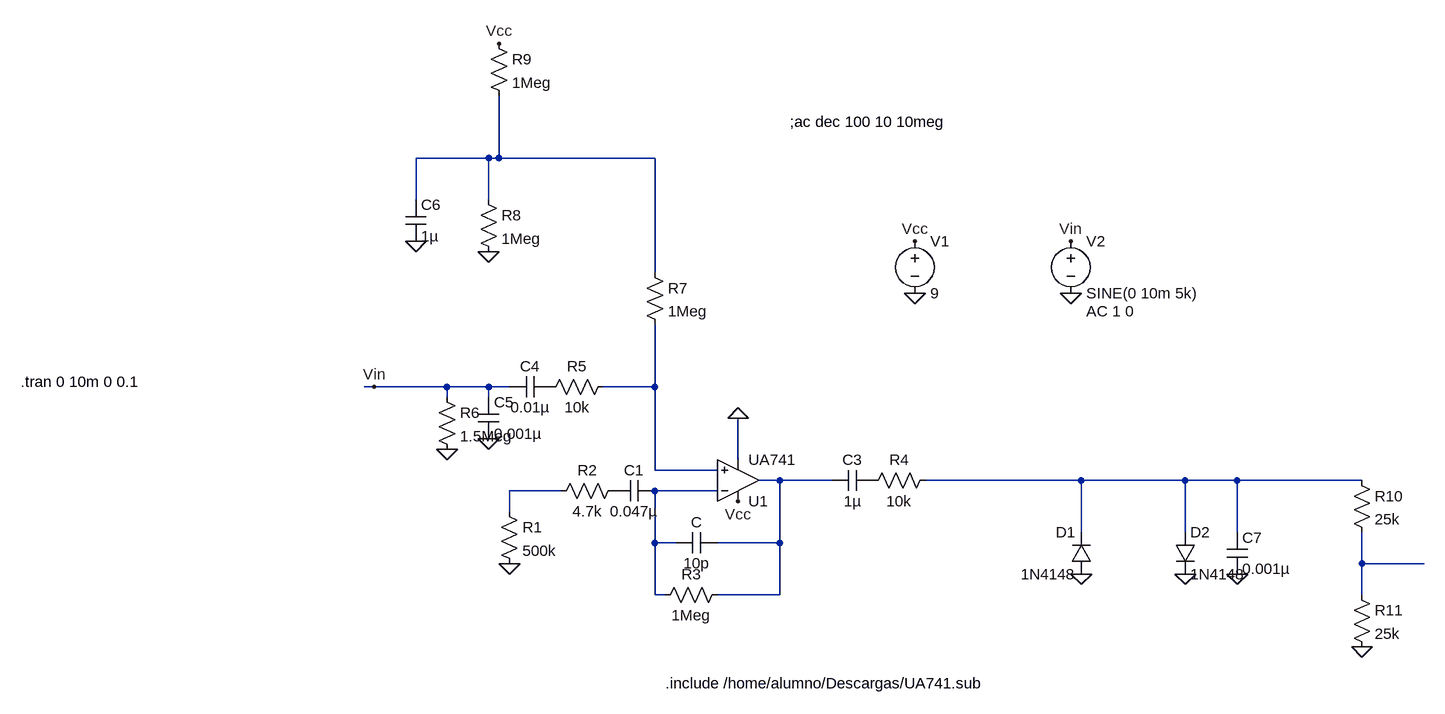
[diagram p0: schematic circuito_rta_frecuencia.asc]
circuito_rta_frecuencia.asc, the LTspice schematic file:
Version 4
SHEET 1 1428 936
WIRE -16 112 -128 112
WIRE 0 112 0 16
WIRE 0 112 -16 112
WIRE 240 112 0 112
WIRE -128 176 -128 112
WIRE -16 176 -16 112
WIRE 240 288 240 112
WIRE -192 464 -208 464
WIRE -80 464 -192 464
WIRE -16 464 -80 464
WIRE 16 464 -16 464
WIRE 240 464 240 368
WIRE 240 464 160 464
WIRE -80 480 -80 464
WIRE -16 480 -16 464
WIRE 368 576 368 512
WIRE 240 592 240 464
WIRE 336 592 240 592
WIRE 432 608 400 608
WIRE 512 608 432 608
WIRE 896 608 656 608
WIRE 1056 608 896 608
WIRE 1136 608 1056 608
WIRE 1328 608 1136 608
WIRE 96 624 16 624
WIRE 336 624 240 624
WIRE 16 656 16 624
WIRE 896 688 896 608
WIRE 1056 688 1056 608
WIRE 1136 688 1136 608
WIRE 240 704 240 624
WIRE 272 704 240 704
WIRE 432 704 432 608
WIRE 432 704 336 704
WIRE 1328 736 1328 688
WIRE 1424 736 1328 736
WIRE 240 784 240 704
WIRE 256 784 240 784
WIRE 432 784 432 704
WIRE 432 784 336 784
WIRE 1328 784 1328 736
FLAG 16 736 0
FLAG 368 512 0
FLAG -80 560 0
FLAG -16 544 0
FLAG -128 240 0
FLAG -16 256 0
FLAG 896 752 0
FLAG 1056 752 0
FLAG 1136 752 0
FLAG 1328 864 0
FLAG 640 240 Vcc
FLAG 0 -64 Vcc
FLAG 880 240 Vin
FLAG -192 464 Vin
FLAG 640 320 0
FLAG 880 320 0
FLAG 368 640 Vcc
SYMBOL res 0 640 R0
SYMATTR InstName R1
SYMATTR Value 500k
SYMBOL res 192 608 R90
WINDOW 0 0 56 VBottom 2
WINDOW 3 32 56 VTop 2
SYMATTR InstName R2
SYMATTR Value 4.7k
SYMBOL cap 240 608 R90
WINDOW 0 0 32 VBottom 2
WINDOW 3 32 32 VTop 2
SYMATTR InstName C1
SYMATTR Value 0.047µ
SYMBOL cap 336 688 R90
WINDOW 0 0 32 VBottom 2
WINDOW 3 32 32 VTop 2
SYMATTR InstName C
SYMATTR Value 10p
SYMBOL res 352 768 R90
WINDOW 0 0 56 VBottom 2
WINDOW 3 32 56 VTop 2
SYMATTR InstName R3
SYMATTR Value 1Meg
SYMBOL Opamps\\opamp2 368 672 M180
SYMATTR InstName U1
SYMATTR Value UA741
SYMBOL cap 576 592 R90
WINDOW 0 0 32 VBottom 2
WINDOW 3 32 32 VTop 2
SYMATTR InstName C3
SYMATTR Value 1µ
SYMBOL res 672 592 R90
WINDOW 0 0 56 VBottom 2
WINDOW 3 32 56 VTop 2
SYMATTR InstName R4
SYMATTR Value 10k
SYMBOL res 176 448 R90
WINDOW 0 0 56 VBottom 2
WINDOW 3 32 56 VTop 2
SYMATTR InstName R5
SYMATTR Value 10k
SYMBOL cap 80 448 R90
WINDOW 0 0 32 VBottom 2
WINDOW 3 32 32 VTop 2
SYMATTR InstName C4
SYMATTR Value 0.01µ
SYMBOL cap -32 480 R0
SYMATTR InstName C5
SYMATTR Value 0.001µ
SYMBOL res -96 464 R0
SYMATTR InstName R6
SYMATTR Value 1.5Meg
SYMBOL res 224 272 R0
SYMATTR InstName R7
SYMATTR Value 1Meg
SYMBOL cap -144 176 R0
SYMATTR InstName C6
SYMATTR Value 1µ
SYMBOL res -32 160 R0
SYMATTR InstName R8
SYMATTR Value 1Meg
SYMBOL res -16 -80 R0
SYMATTR InstName R9
SYMATTR Value 1Meg
SYMBOL res 1312 592 R0
SYMATTR InstName R10
SYMATTR Value 25k
SYMBOL res 1312 768 R0
SYMATTR InstName R11
SYMATTR Value 25k
SYMBOL diode 912 752 R180
WINDOW 0 24 64 Left 2
WINDOW 3 24 0 Left 2
SYMATTR InstName D1
SYMATTR Value 1N4148
SYMBOL diode 1040 688 R0
SYMATTR InstName D2
SYMATTR Value 1N4148
SYMBOL cap 1120 688 R0
SYMATTR InstName C7
SYMATTR Value 0.001µ
SYMBOL voltage 640 224 R0
SYMATTR InstName V1
SYMATTR Value 9
SYMBOL voltage 880 224 R0
WINDOW 123 24 124 Left 2
WINDOW 39 0 0 Left 2
SYMATTR InstName V2
SYMATTR Value SINE(0 10m 5k)
SYMATTR Value2 AC 1 0
TEXT 256 920 Left 2 !.include /home/alumno/Descargas/UA741.sub
TEXT 448 56 Left 2 !;ac dec 100 10 10meg
TEXT -736 456 Left 2 !.tran 0 10m 0 0.1

The netlist it stands for:
* circuito_rta_frecuencia.asc
R1 N005 0 500k
R2 P001 N005 4.7k
C1 N006 P001 0.047µ
C N003 N006 10p
R3 N003 N006 1Meg
XU1 N002 N006 Vcc 0 N003 UA741  ; pins In+ In- V+ V- OUT
C3 P002 N003 1µ
R4 N004 P002 10k
R5 N002 P003 10k
C4 P003 Vin 0.01µ
C5 Vin 0 0.001µ
R6 Vin 0 1.5Meg
R7 N001 N002 1Meg
C6 N001 0 1µ
R8 N001 0 1Meg
R9 Vcc N001 1Meg
R10 N004 N007 25k
R11 N007 0 25k
D1 0 N004 1N4148
D2 N004 0 1N4148
C7 N004 0 0.001µ
V1 Vcc 0 9
V2 Vin 0 SINE(0 10m 5k) AC 1 0
.model D D
.lib standard.dio
.include /home/alumno/Descargas/UA741.sub
;ac dec 100 10 10meg
.tran 0 10m 0 0.1
.backanno
.end